# Altium schematic sheet BombasFSM.SchDoc
size A4
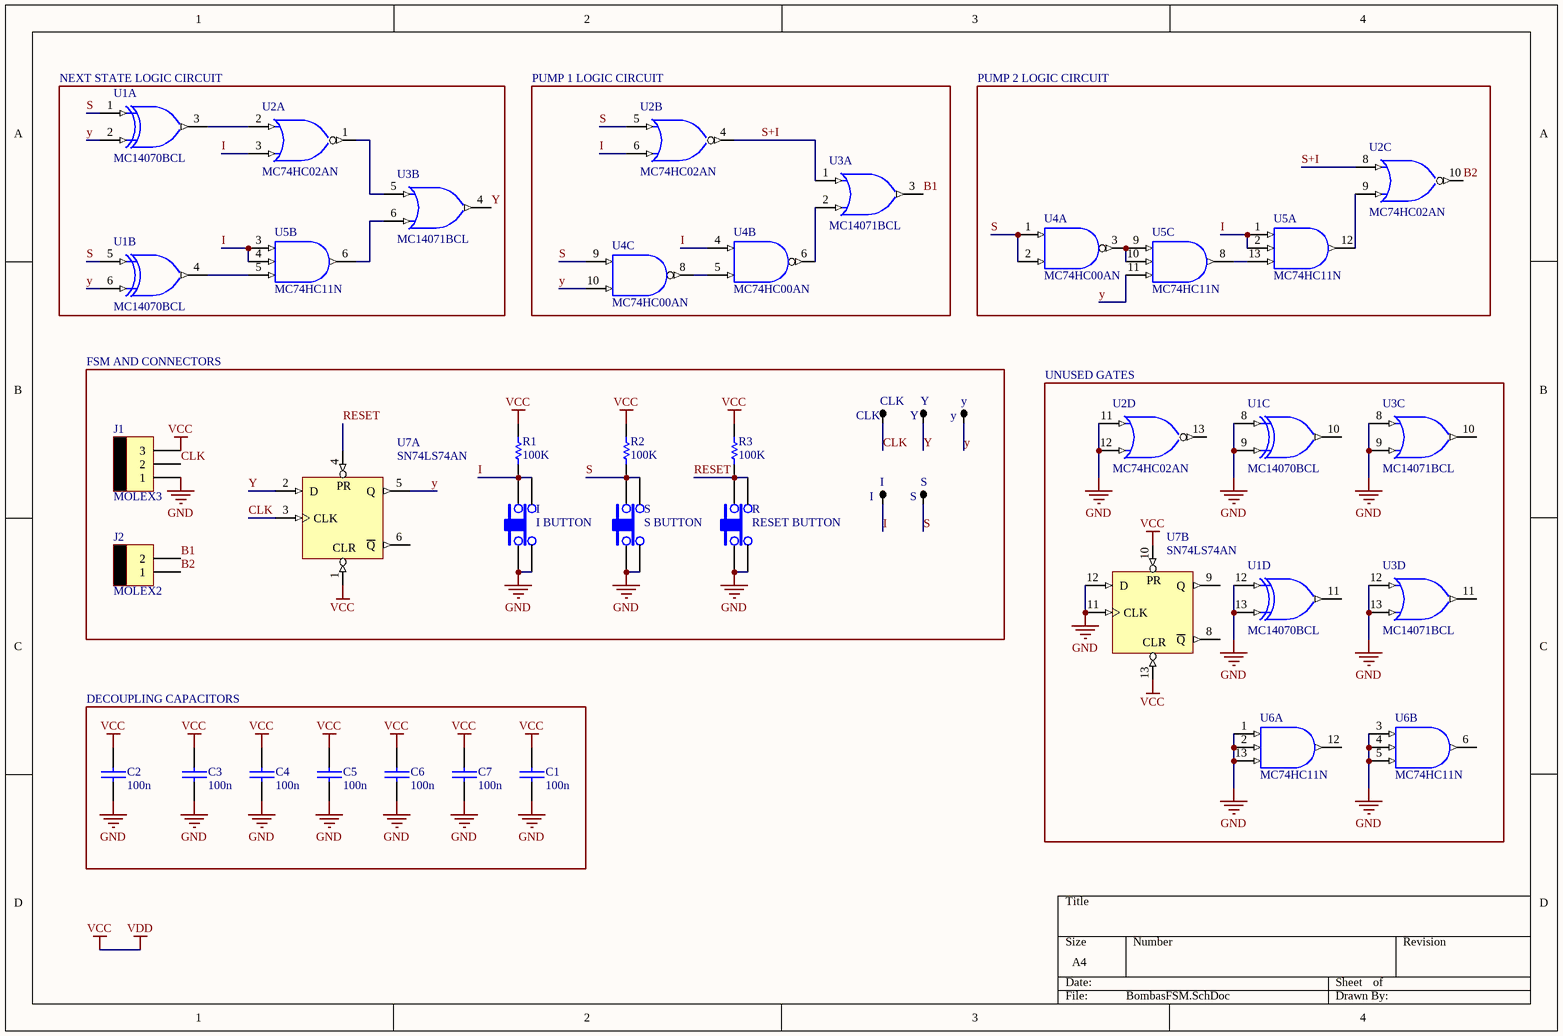
[diagram p0: BombasFSM.SchDoc]

## Parts
(Parts that share a designator on the sheet are numbered #1, #2 ... from top to bottom, then left to right.)
C1  100n  [CAP100]
C2  100n  [CAP100]
C3  100n  [CAP100]
C4  100n  [CAP100]
C5  100n  [CAP100]
C6  100n  [CAP100]
C7  100n  [CAP100]
CLK  CLK  [TPTH]
I#1  I  [TPTH]
I#2  I BUTTON  [TACTSWITCH]
J1  MOLEX3  [MOLEX3]
J2  MOLEX2  [MOLEX2]
R  RESET BUTTON  [TACTSWITCH]
R1  100K  [0805]
R2  100K  [0805]
R3  100K  [0805]
S#1  S  [TPTH]
S#2  S BUTTON  [TACTSWITCH]
U1  MC14070BCL  [632-08]  (parts A,B,C,D of 4)
U2  MC74HC02AN  [646-06]  (parts A,B,C,D of 4)
U3  MC14071BCL  [632-08]  (parts A,B,C,D of 4)
U4  MC74HC00AN  [646-06]  (parts A,B,C of 4)
U5  MC74HC11N  [646-06]  (parts A,B,C of 3)
U6  MC74HC11N  [646-06]  (parts A,B of 3)
U7  SN74LS74AN  [N014D]  (parts A,B of 2)
Y#1  Y  [TPTH]
y#2  y  [TPTH]

## Blocks framed on the sheet
NEXT STATE LOGIC CIRCUIT: U1-U3 U5
PUMP 1 LOGIC CIRCUIT: U2-U4
PUMP 2 LOGIC CIRCUIT: U2 U4 U5
FSM AND CONNECTORS: CLK I#1 I#2 J1 J2 R R1-R3 S#1 S#2 U7 Y#1 y#2
UNUSED GATES: U1-U3 U6 U7
DECOUPLING CAPACITORS: C1-C7

## Nets
GND: C1.2 C2.2 C3.2 C4.2 C5.2 C6.2 C7.2 I#2.1 I#2.2 J1.1 R.1 R.2 S#2.1 S#2.2 U1.7(GND) U1.8(A) U1.9(B) U1.12(A) U1.13(B) U2.7(GND) U2.11(A) U2.12(B) U3.7(GND) U3.8(A) U3.9(B) U3.12(A) U3.13(B) U4.7(GND) U5.7(GND) U6.1(A) U6.2(B) U6.3(A) U6.4(B) U6.5(C) U6.7(GND) U6.13(C) U7.7(GND) U7.11(CLK) U7.12(D)
VCC: C1.1 C2.1 C3.1 C4.1 C5.1 C6.1 C7.1 J1.3 R1.2 R2.2 R3.2 U1.14(VDD) U2.14(VDD) U3.14(VDD) U4.14(VDD) U5.14(VDD) U6.14(VDD) U7.1(CLR) U7.10(PR) U7.13(CLR) U7.14(VCC)  [also labelled VDD]
B1: J2.2 U3.3(Y)
B2: J2.1 U2.10(Y)
CLK: CLK.1 J1.2 U7.3(CLK)
I: I#1.1 I#2.3 I#2.4 R1.1 U2.3(B) U2.6(B) U4.4(A) U5.1(A) U5.2(B) U5.3(A) U5.4(B)
RESET: R.3 R.4 R3.1 U7.4(PR)
S: R2.1 S#1.1 S#2.3 S#2.4 U1.1(A) U1.5(A) U2.5(A) U4.1(A) U4.2(B) U4.9(A)
S+I: U2.4(Y) U2.8(A) U3.1(A)
y: U1.2(B) U1.6(B) U3.4(Y) U4.10(B) U5.11(C) U7.2(D) U7.5(Q) Y#1.1 y#2.1
NetU1_3: U1.3(Y) U2.2(A)
NetU1_4: U1.4(Y) U5.5(C)
NetU2_1: U2.1(Y) U3.5(A)
NetU2_9: U2.9(B) U5.12(Y)
NetU3_2: U3.2(B) U4.6(Y)
NetU3_6: U3.6(B) U5.6(Y)
NetU4_3: U4.3(Y) U5.9(A) U5.10(B)
NetU4_5: U4.5(B) U4.8(Y)
NetU5_8: U5.8(Y) U5.13(C)

Not connected (* = marked no-connect by the designer): U1 10(Y) 11(Y); U2 13(Y); U3 10(Y) 11(Y); U6 6(Y) 12(Y); U7 6(~{Q}) 8(~{Q}) 9(Q)

## Library data of the parts
C1-C7 = CAP
CLK I#1 S#1 Y#1 y#2 = TP
I#2 R S#2 = TACT SWITCH: Value: PULSADOR; Footprint: PULSADOR
R1-R3 = RES
U1 = MC14070BCL: Quad XOR Gate; Published: 15-Apr-2002; DatasheetVersion: 1995; PackageVersion: 1995; PackageReference: 632-08; Publisher: Altium Limited; PackageDescription: DIP; 14 Leads; Row Spacing 7.62 mm; Pitch 2.54 mm; ComponentLink1Description: Manufacturer Link; ComponentLink1URL: http://www.onsemi.com/; ComponentLink2Description: Datasheet; ComponentLink2URL: http://www.onsemi.com/pub/Collateral/MC14070B-D.PDF
U2 = MC74HC02AN: Quad 2-Input NOR Gate; Published: 17-Jul-2002; LatestRevisionDate: 06-Jun-2005; LatestRevisionNote: Stylized 3D Model Added; DatasheetVersion: 1989; PackageVersion: 1997; PackageReference: 646-06; Publisher: Altium Limited; PackageDescription: DIP; 14 Leads; Row Spacing 7.62 mm; Pitch 2.54 mm; ComponentLink1Description: Manufacturer Link; ComponentLink1URL: http://www.onsemi.com/site/products/parametrics/0,4446,247,00.html; ComponentLink2Description: Ibis Model; ComponentLink2URL: http://www.onsemi.com/pub/Collateral/MC54HC02AJ.IBS
U3 = MC14071BCL: Quad 2-Input OR Gate; Published: 15-Apr-2002; DatasheetVersion: 1995; PackageVersion: 1995; PackageReference: 632-08; Publisher: Altium Limited; PackageDescription: DIP; 14 Leads; Row Spacing 7.62 mm; Pitch 2.54 mm; ComponentLink1Description: Manufacturer Link; ComponentLink1URL: http://www.onsemi.com/; ComponentLink2Description: Datasheet; ComponentLink2URL: http://www.onsemi.com/pub/Collateral/MC14001B-D.PDF
U4 = MC74HC00AN: Quad 2-Input NAND Gate; Published: 17-Jul-2002; LatestRevisionDate: 06-Jun-2005; LatestRevisionNote: Stylized 3D Model Added; DatasheetVersion: 1989; PackageVersion: 1997; PackageReference: 646-06; Publisher: Altium Limited; PackageDescription: DIP; 14 Leads; Row Spacing 7.62 mm; Pitch 2.54 mm; ComponentLink1Description: Manufacturer Link; ComponentLink1URL: http://www.onsemi.com/site/products/parametrics/0,4446,247,00.html; ComponentLink2Description: Ibis Model; ComponentLink2URL: http://www.onsemi.com/pub/Collateral/MC54HC00AJ.IBS
U5 U6 = MC74HC11N: Triple 3-Input AND Gate; Published: 17-Jul-2002; LatestRevisionDate: 06-Jun-2005; LatestRevisionNote: Stylized 3D Model Added; DatasheetVersion: 1989; PackageVersion: 1997; PackageReference: 646-06; Publisher: Altium Limited; PackageDescription: DIP; 14 Leads; Row Spacing 7.62 mm; Pitch 2.54 mm; ComponentLink1Description: Manufacturer Link; ComponentLink1URL: http://www.onsemi.com/site/products/parametrics/0,4446,247,00.html; ComponentLink2Description: Ibis Model; ComponentLink2URL: http://www.onsemi.com/pub/Collateral/MC54HC11J.IBS
U7 = SN74LS74AN: Dual D-Type Positive-Edge-Triggered Flip-Flop with Preset and Clear; Value: 74LS74; Footprint: DIP14